# Altium schematic sheet Hamamatsu_acond.SchDoc: CSN Detector V3_1
size A4; Author: RCP; DrawnBy: RCP; Address1: LIM-HGGM; Address3: RCP; DocumentNumber: 1; Revision: 1; SheetNumber: 1; SheetTotal: 2; PageSetup: Record=PageOptions|CenterHorizontal=True|CenterVertical=True|PrintScale=1.00|XCorrection=1.00|YCorrection=1.00|PrintKind=0|BorderSize=5000000|LeftOffset=0|BottomOffset=0|Orientation=2|PaperLength=1000|PaperWidth=1000|Scale=100|PaperSource=7|PrintQuality=-4|MediaType=1|DitherType=10|PaperKind=A4|PrintScaleMode=1
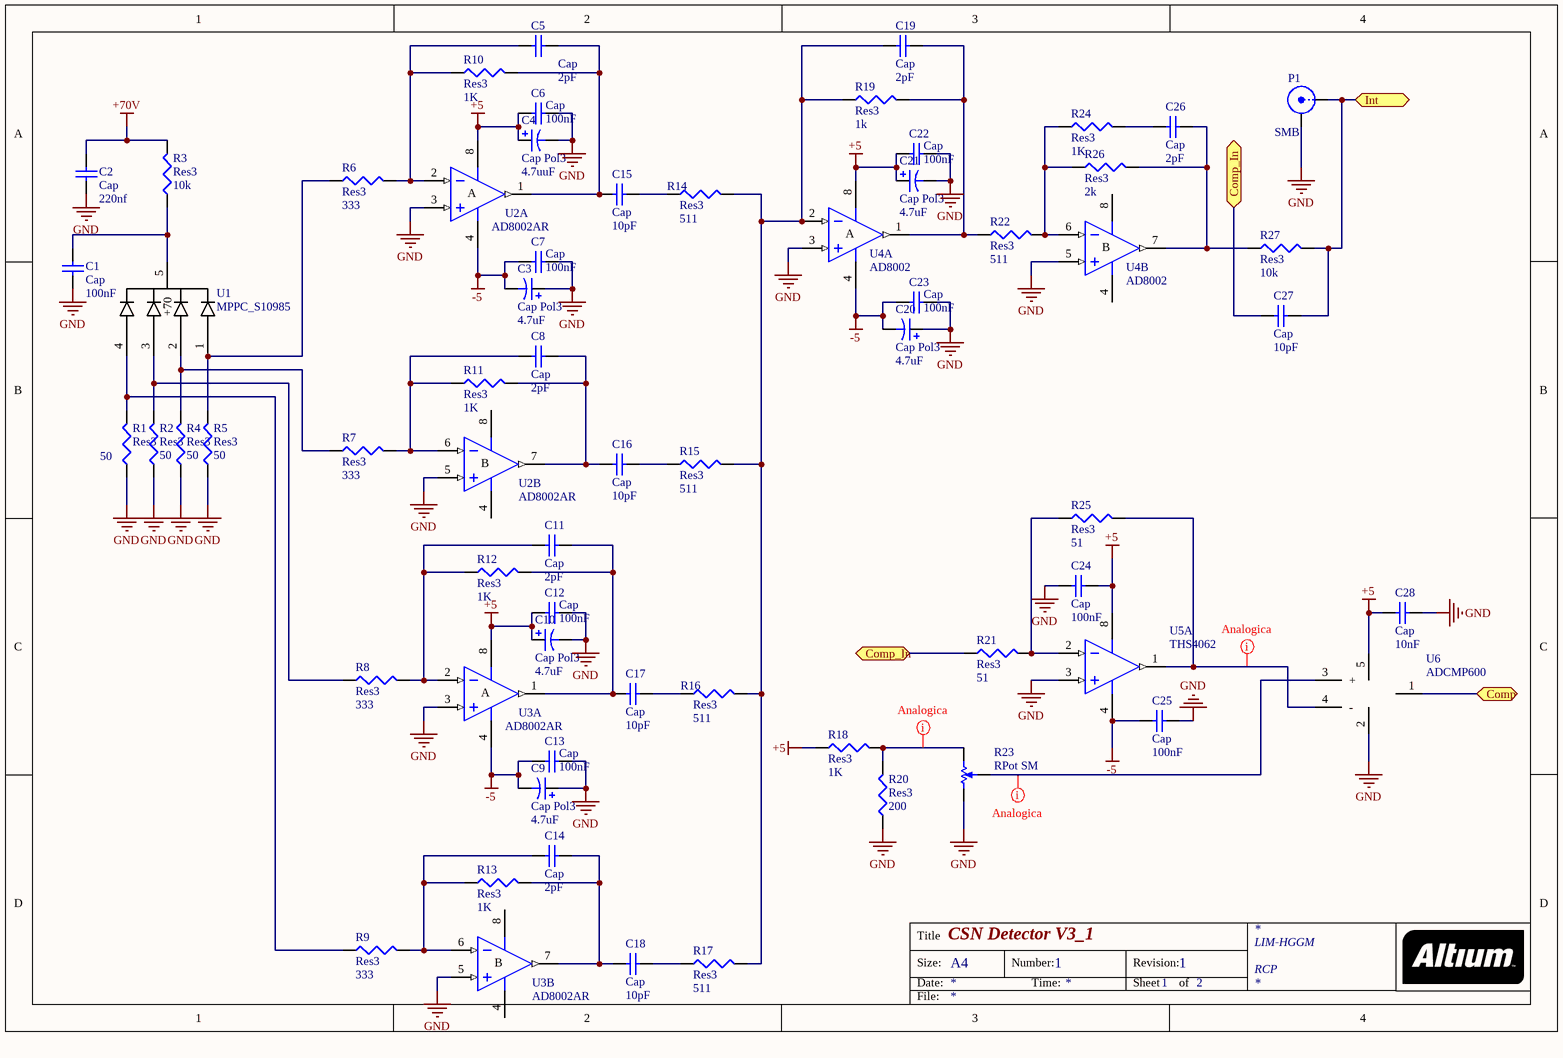
[diagram p0: Hamamatsu_acond.SchDoc]

## Parts
C1  Cap  value 100nF  [C0805]
C2  Cap  value 220nf  [C0805]
C3  Cap Pol3  value 4.7uF  [6-0805_N]
C4  Cap Pol3  value 4.7uuF  [6-0805_N]
C5  Cap  value 2pF  [C0805]
C6  Cap  value 100nF  [6-0805_N]
C7  Cap  value 100nF  [6-0805_N]
C8  Cap  value 2pF  [C0805]
C9  Cap Pol3  value 4.7uF  [6-0805_N]
C10  Cap Pol3  value 4.7uF  [6-0805_N]
C11  Cap  value 2pF  [C0805]
C12  Cap  value 100nF  [6-0805_N]
C13  Cap  value 100nF  [6-0805_N]
C14  Cap  value 2pF  [C0805]
C15  Cap  value 10pF  [C0805]
C16  Cap  value 10pF  [C0805]
C17  Cap  value 10pF  [C0805]
C18  Cap  value 10pF  [C0805]
C19  Cap  value 2pF  [C0805]
C20  Cap Pol3  value 4.7uF  [6-0805_N]
C21  Cap Pol3  value 4.7uF  [6-0805_N]
C22  Cap  value 100nF  [6-0805_N]
C23  Cap  value 100nF  [6-0805_N]
C24  Cap  value 100nF  [6-0805_N]
C25  Cap  value 100nF  [6-0805_N]
C26  Cap  value 2pF  [C0805]
C27  Cap  value 10pF  [C0805]
C28  Cap  value 10nF  [6-0805_N]
P1  SMB  [SMB_V-RJ45]
R1  Res3  value 50  [6-0805_N]
R2  Res3  value 50  [6-0805_N]
R3  Res3  value 10k  [6-0805_N]
R4  Res3  value 50  [6-0805_N]
R5  Res3  value 50  [6-0805_N]
R6  Res3  value 333  [6-0805_N]
R7  Res3  value 333  [6-0805_N]
R8  Res3  value 333  [6-0805_N]
R9  Res3  value 333  [6-0805_N]
R10  Res3  value 1K  [6-0805_N]
R11  Res3  value 1K  [6-0805_N]
R12  Res3  value 1K  [6-0805_N]
R13  Res3  value 1K  [6-0805_N]
R14  Res3  value 511  [6-0805_N]
R15  Res3  value 511  [6-0805_N]
R16  Res3  value 511  [6-0805_N]
R17  Res3  value 511  [6-0805_N]
R18  Res3  value 1K  [6-0805_N]
R19  Res3  value 1k  [6-0805_N]
R20  Res3  value 200  [6-0805_N]
R21  Res3  value 51  [6-0805_N]
R22  Res3  value 511  [6-0805_N]
R23  RPot SM  [POT4MM-2]
R24  Res3  value 1K  [6-0805_N]
R25  Res3  value 51  [6-0805_N]
R26  Res3  value 2k  [6-0805_N]
R27  Res3  value 10k  [6-0805_N]
U1  MPPC_S10985  [S10985_HAM]
U2  AD8002AR  [SO-8_M]  (parts A,B of 2)
U3  AD8002AR  [SO-8_M]  (parts A,B of 2)
U4  AD8002  [SO-8_M]  (parts A,B of 2)
U5  THS4062  [S8_N]  (part A of 2)
U6  ADCMP600  [SOT23-5_N]

## Ports
Comp, Comp_In, Int

## Nets
+5: C4.1 C6.2 C10.1 C12.2 C21.1 C22.2 C24.2 C28.1 R18.1 U2.8(V+) U3.8(V+) U4.8(V+) U5.8(V+) U6.5
+70V: C2.2 R3.2
-5: C3.2 C7.2 C9.2 C13.2 C20.2 C23.2 C25.1 U2.4(V-) U3.4(V-) U4.4(V-) U5.4(V-)
GND: C1.1 C2.1 C3.1 C4.2 C6.1 C7.1 C9.1 C10.2 C12.1 C13.1 C20.1 C21.2 C22.1 C23.1 C24.1 C25.2 C28.2 P1.2(Y) R1.1 R2.1 R4.1 R5.1 R20.1 R23.CCW(-) U2.3(IN+) U2.5(IN+) U3.3(IN+) U3.5(IN+) U4.3(IN+) U4.5(IN+) U5.3(IN+) U6.2
Comp: U6.1 ; port Comp
Comp_In: C27.1 R21.1 ; port Comp_In
Int: C27.2 P1.1(X) R27.2 ; port Int
NetC1_2: C1.2 R3.1 U1.5(+70)
NetC5_1: C5.1 R6.2 R10.1 U2.2(IN-)
NetC5_2: C5.2 C15.1 R10.2 U2.1(OUT)
NetC8_1: C8.1 R7.2 R11.1 U2.6(IN-)
NetC8_2: C8.2 C16.1 R11.2 U2.7(OUT)
NetC11_1: C11.1 R8.2 R12.1 U3.2(IN-)
NetC11_2: C11.2 C17.1 R12.2 U3.1(OUT)
NetC14_1: C14.1 R9.2 R13.1 U3.6(IN-)
NetC14_2: C14.2 C18.1 R13.2 U3.7(OUT)
NetC15_2: C15.2 R14.1
NetC16_2: C16.2 R15.1
NetC17_2: C17.2 R16.1
NetC18_2: C18.2 R17.1
NetC19_1: C19.1 R14.2 R15.2 R16.2 R17.2 R19.1 U4.2(IN-)
NetC19_2: C19.2 R19.2 R22.1 U4.1(OUT)
NetC26_1: C26.1 R24.2
NetC26_2: C26.2 R26.2 R27.1 U4.7(OUT)
NetR1_2: R1.2 R9.1 U1.4
NetR2_2: R2.2 R8.1 U1.3
NetR4_2: R4.2 R7.1 U1.2(Pin2)
NetR5_2: R5.2 R6.1 U1.1(Pin1)
NetR18_2: R18.2 R20.2 R23.CW(+)
NetR21_2: R21.2 R25.1 U5.2(IN-)
NetR22_2: R22.2 R24.1 R26.1 U4.6(IN-)
NetR23_W: R23.W U6.3(+)
NetR25_2: R25.2 U5.1(OUT) U6.4(-)

## Layout directives
net class analog: NetR18_2, NetR23_W, NetR25_2

## Notes on the sheet
- Title
- Size:
- Date:
- A4
- Number:
- Time:
- Revision:
- Sheet
- of
- File:
- (in symbol AD8002AR, part A) A
- (in symbol AD8002AR, part B) B

## Library data of the parts
C1 C2 C5-C8 C11-C19 C22-C28 = Cap: Capacitor; Published: 8-Jun-2000; LatestRevisionDate: 17-Jul-2002; LatestRevisionNote: Re-released for DXP Platform.; PackageReference: RAD-0.3; Publisher: Altium Limited; PackageDescription: Radial Cap, Thru-Hole; 2 Leads; 0.3 in Pin Spacing
C3 C4 C9 C10 C20 C21 = Cap Pol3: Polarized Capacitor (Surface Mount); Published: 8-Jun-2000; LatestRevisionDate: 29-May-2009; LatestRevisionNote: IPC-7351 Footprint Added.; PackageReference: C0805; Publisher: Altium Limited; PackageDescription: Chip Capacitor
P1 = SMB: SMB Straight Connector; LatestRevisionDate: 17-Jul-2002; LatestRevisionNote: Re-released for DXP Platform.; Publisher: Altium Limited
R1-R22 R24-R27 = Res3: Resistor; Published: 8-Jun-2000; LatestRevisionDate: 29-May-2009; LatestRevisionNote: IPC-7351 Footprint Added.; PackageReference: J1-0603; Publisher: Altium Limited; PackageDescription: Chip Resistor
R23 = RPot SM: Square Trimming Potentiometer; Published: 17-Dec-2003; DatasheetVersion: Oct-2003; PackageReference: POT4MM-2; Publisher: Altium Limited; PackageDescription: Square Trimming Potentiometer; ComponentLink1Description: Manufacturer Link; ComponentLink1URL: http://bourns.com/2/search.html
U2-U4 = AD8002AR: Dual 600MHz, 50mW Current Feedback Amplifier; Published: 8-Jun-2000; LatestRevisionDate: 13-Apr-2006; LatestRevisionNote: IPC-7351 Footprint Added.; DatasheetVersion: REV. C 1999; PackageVersion: revA; PackageReference: SO-8; Publisher: Altium Limited; PackageDescription: 8-Pin Small Outline Integrated Circuit 1.27 mm Pitch; Code_JEDEC: MS-012-AA; Code_IPC: SOIC127P600-8; ComponentLink1Description: Manufacturer Link; ComponentLink1URL: http://www.analog.com/en/prod/0,,759_786_AD8002%2C00.html; ComponentLink2Description: Datasheet; ComponentLink2URL: http://www.analog.com/UploadedFiles/Data_Sheets/147523773AD8002_d.pdf
U5 = LT1253CS8: Low Cost Dual Video Amplifier; Note: 1003; Published: 8-Jun-2000; LatestRevisionDate: 13-Apr-2006; LatestRevisionNote: IPC-7351 Footprint Added.; DatasheetVersion: 1996; PackageReference: S8; Publisher: Altium Limited; PackageDescription: 8-Pin Small Outline Integrated Circuit 1.27 mm Pitch; Code_JEDEC: MS-012-AA; Code_IPC: SOIC127P600-8; ComponentLink1Description: Manufacturer Link; ComponentLink1URL: http://www.linear.com/; ComponentLink2Description: Datasheet; ComponentLink2URL: http://www.linear.com/pc/downloadDocument.do?navId=H0,C1,C1154,C1009,C1022,P1423,D1129